# Altium schematic sheet top_sheet.SchDoc: Jetson Xavier NX Board
size A3; PageSetup: Record=PageOptions|CenterHorizontal=True|CenterVertical=True|PrintScale=0.97|XCorrection=1.00|YCorrection=1.00|PrintKind=1|BorderSize=5000000|LeftOffset=0|BottomOffset=0|Orientation=2|PaperLength=2970|PaperWidth=2100|Scale=100|PaperSource=7|PrintQuality=600|MediaType=1|DitherType=10|PaperKind=A4|PrintScaleMode=1; Organization: Altium Limited; Address1: 3 Minna Close; Address2: Belrose; Address3: NSW 2085; Address4: Australia; Revision: Rev01
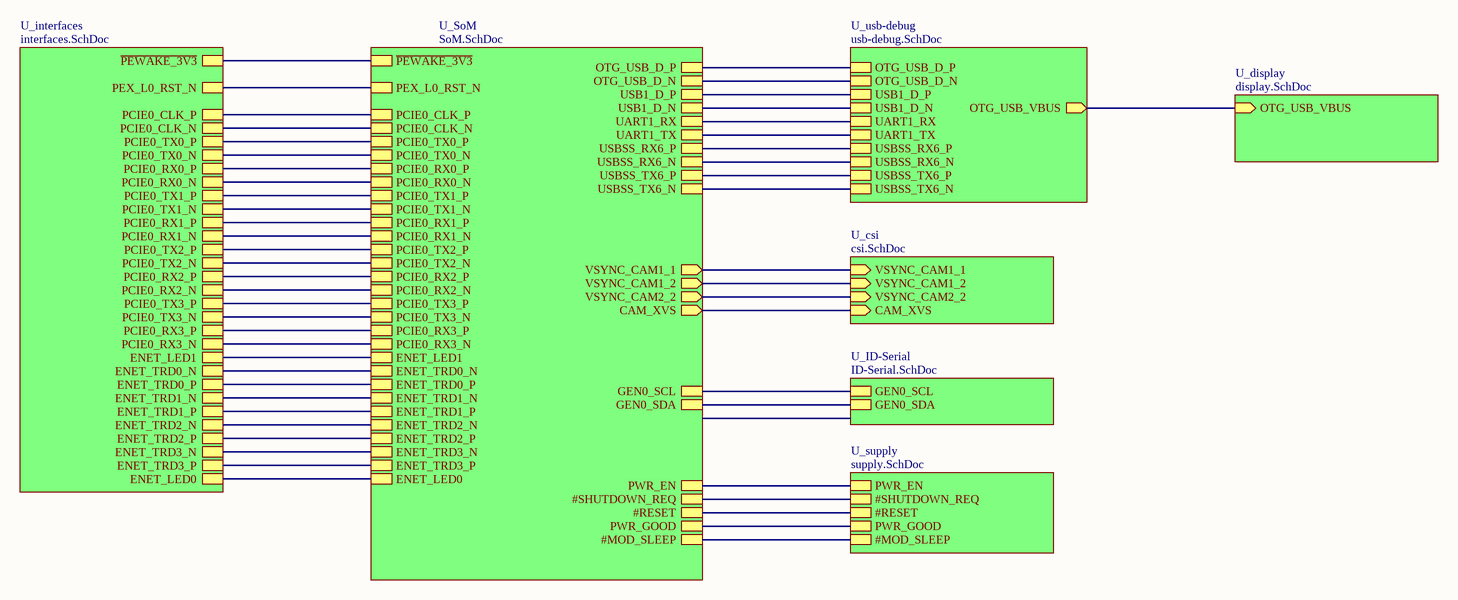
[diagram p0: top_sheet.SchDoc]

## Sub-sheets
U_csi = csi.SchDoc: VSYNC_CAM1_1 (in), VSYNC_CAM1_2 (in), VSYNC_CAM2_2 (in), CAM_XVS (in)
U_display = display.SchDoc: OTG_USB_VBUS (in)
U_ID-Serial = ID-Serial.SchDoc: GEN0_SCL, GEN0_SDA
U_interfaces = interfaces.SchDoc: ~{PEWAKE_3V3}, PEX_L0_RST_N, PCIE0_CLK_P, PCIE0_CLK_N, PCIE0_TX0_P, PCIE0_TX0_N, PCIE0_RX0_P, PCIE0_RX0_N, PCIE0_TX1_P, PCIE0_TX1_N, PCIE0_RX1_P, PCIE0_RX1_N, PCIE0_TX2_P, PCIE0_TX2_N, PCIE0_RX2_P, PCIE0_RX2_N, PCIE0_TX3_P, PCIE0_TX3_N, PCIE0_RX3_P, PCIE0_RX3_N, ENET_LED1, ENET_TRD0_N, ENET_TRD0_P, ENET_TRD1_N, ENET_TRD1_P, ENET_TRD2_N, ENET_TRD2_P, ENET_TRD3_N, ENET_TRD3_P, ENET_LED0
U_SoM = SoM.SchDoc: VSYNC_CAM1_1 (out), VSYNC_CAM1_2 (out), VSYNC_CAM2_2 (out), ~{PEWAKE_3V3}, PEX_L0_RST_N, PCIE0_CLK_P, PCIE0_CLK_N, PCIE0_TX0_P, PCIE0_TX0_N, PCIE0_RX0_P, PCIE0_RX0_N, PCIE0_TX1_P, PCIE0_TX1_N, PCIE0_RX1_P, PCIE0_RX1_N, PCIE0_TX2_P, PCIE0_TX2_N, PCIE0_RX2_P, PCIE0_RX2_N, PCIE0_TX3_P, PCIE0_TX3_N, PCIE0_RX3_P, PCIE0_RX3_N, ENET_LED1, ENET_TRD0_N, ENET_TRD0_P, ENET_TRD1_N, ENET_TRD1_P, ENET_TRD2_N, ENET_TRD2_P, ENET_TRD3_N, ENET_TRD3_P, ENET_LED0, UART1_TX, UART1_RX, PWR_EN, #SHUTDOWN_REQ, #RESET, PWR_GOOD, USBSS_TX6_N, USBSS_TX6_P, USBSS_RX6_N, USBSS_RX6_P, #MOD_SLEEP, OTG_USB_D_N, OTG_USB_D_P, USB1_D_N, USB1_D_P, GEN0_SCL, GEN0_SDA, CAM_XVS (out)
U_supply = supply.SchDoc: PWR_EN, #SHUTDOWN_REQ, #RESET, PWR_GOOD, #MOD_SLEEP
U_usb-debug = usb-debug.SchDoc: OTG_USB_VBUS (out), USBSS_TX6_N, USBSS_TX6_P, USBSS_RX6_N, USBSS_RX6_P, UART1_TX, UART1_RX, OTG_USB_D_N, OTG_USB_D_P, USB1_D_N, USB1_D_P

## Nets
(unnamed): sheet U_csi/VSYNC_CAM1_1, sheet U_SoM/VSYNC_CAM1_1
(unnamed): sheet U_csi/VSYNC_CAM1_2, sheet U_SoM/VSYNC_CAM1_2
(unnamed): sheet U_csi/VSYNC_CAM2_2, sheet U_SoM/VSYNC_CAM2_2
(unnamed): sheet U_csi/CAM_XVS, sheet U_SoM/CAM_XVS
(unnamed): sheet U_ID-Serial/GEN0_SCL, sheet U_SoM/GEN0_SCL
(unnamed): sheet U_ID-Serial/GEN0_SDA, sheet U_SoM/GEN0_SDA
(unnamed): sheet U_interfaces/~{PEWAKE_3V3}, sheet U_SoM/~{PEWAKE_3V3}
(unnamed): sheet U_interfaces/PEX_L0_RST_N, sheet U_SoM/PEX_L0_RST_N
(unnamed): sheet U_interfaces/PCIE0_CLK_P, sheet U_SoM/PCIE0_CLK_P
(unnamed): sheet U_interfaces/PCIE0_CLK_N, sheet U_SoM/PCIE0_CLK_N
(unnamed): sheet U_interfaces/PCIE0_TX0_P, sheet U_SoM/PCIE0_TX0_P
(unnamed): sheet U_interfaces/PCIE0_TX0_N, sheet U_SoM/PCIE0_TX0_N
(unnamed): sheet U_interfaces/PCIE0_RX0_P, sheet U_SoM/PCIE0_RX0_P
(unnamed): sheet U_interfaces/PCIE0_RX0_N, sheet U_SoM/PCIE0_RX0_N
(unnamed): sheet U_interfaces/PCIE0_TX1_P, sheet U_SoM/PCIE0_TX1_P
(unnamed): sheet U_interfaces/PCIE0_TX1_N, sheet U_SoM/PCIE0_TX1_N
(unnamed): sheet U_interfaces/PCIE0_RX1_P, sheet U_SoM/PCIE0_RX1_P
(unnamed): sheet U_interfaces/PCIE0_RX1_N, sheet U_SoM/PCIE0_RX1_N
(unnamed): sheet U_interfaces/PCIE0_TX2_P, sheet U_SoM/PCIE0_TX2_P
(unnamed): sheet U_interfaces/PCIE0_TX2_N, sheet U_SoM/PCIE0_TX2_N
(unnamed): sheet U_interfaces/PCIE0_RX2_P, sheet U_SoM/PCIE0_RX2_P
(unnamed): sheet U_interfaces/PCIE0_RX2_N, sheet U_SoM/PCIE0_RX2_N
(unnamed): sheet U_interfaces/PCIE0_TX3_P, sheet U_SoM/PCIE0_TX3_P
(unnamed): sheet U_interfaces/PCIE0_TX3_N, sheet U_SoM/PCIE0_TX3_N
(unnamed): sheet U_interfaces/PCIE0_RX3_P, sheet U_SoM/PCIE0_RX3_P
(unnamed): sheet U_interfaces/PCIE0_RX3_N, sheet U_SoM/PCIE0_RX3_N
(unnamed): sheet U_interfaces/ENET_LED1, sheet U_SoM/ENET_LED1
(unnamed): sheet U_interfaces/ENET_TRD0_N, sheet U_SoM/ENET_TRD0_N
(unnamed): sheet U_interfaces/ENET_TRD0_P, sheet U_SoM/ENET_TRD0_P
(unnamed): sheet U_interfaces/ENET_TRD1_N, sheet U_SoM/ENET_TRD1_N
(unnamed): sheet U_interfaces/ENET_TRD1_P, sheet U_SoM/ENET_TRD1_P
(unnamed): sheet U_interfaces/ENET_TRD2_N, sheet U_SoM/ENET_TRD2_N
(unnamed): sheet U_interfaces/ENET_TRD2_P, sheet U_SoM/ENET_TRD2_P
(unnamed): sheet U_interfaces/ENET_TRD3_N, sheet U_SoM/ENET_TRD3_N
(unnamed): sheet U_interfaces/ENET_TRD3_P, sheet U_SoM/ENET_TRD3_P
(unnamed): sheet U_interfaces/ENET_LED0, sheet U_SoM/ENET_LED0
(unnamed): sheet U_SoM/UART1_TX, sheet U_usb-debug/UART1_TX
(unnamed): sheet U_SoM/UART1_RX, sheet U_usb-debug/UART1_RX
(unnamed): sheet U_SoM/PWR_EN, sheet U_supply/PWR_EN
(unnamed): sheet U_SoM/#SHUTDOWN_REQ, sheet U_supply/#SHUTDOWN_REQ
(unnamed): sheet U_SoM/#RESET, sheet U_supply/#RESET
(unnamed): sheet U_SoM/PWR_GOOD, sheet U_supply/PWR_GOOD
(unnamed): sheet U_SoM/USBSS_TX6_N, sheet U_usb-debug/USBSS_TX6_N
(unnamed): sheet U_SoM/USBSS_TX6_P, sheet U_usb-debug/USBSS_TX6_P
(unnamed): sheet U_SoM/USBSS_RX6_N, sheet U_usb-debug/USBSS_RX6_N
(unnamed): sheet U_SoM/USBSS_RX6_P, sheet U_usb-debug/USBSS_RX6_P
(unnamed): sheet U_SoM/#MOD_SLEEP, sheet U_supply/#MOD_SLEEP
(unnamed): sheet U_SoM/OTG_USB_D_N, sheet U_usb-debug/OTG_USB_D_N
(unnamed): sheet U_SoM/OTG_USB_D_P, sheet U_usb-debug/OTG_USB_D_P
(unnamed): sheet U_SoM/USB1_D_N, sheet U_usb-debug/USB1_D_N
(unnamed): sheet U_SoM/USB1_D_P, sheet U_usb-debug/USB1_D_P
(unnamed): sheet U_usb-debug/OTG_USB_VBUS, sheet U_display/OTG_USB_VBUS

## Notes on the sheet
- Title
- Size:
- Date:
- A3
- Number:
- Time:
- Revision:
- Sheet
- of
- Go360.io
- File: